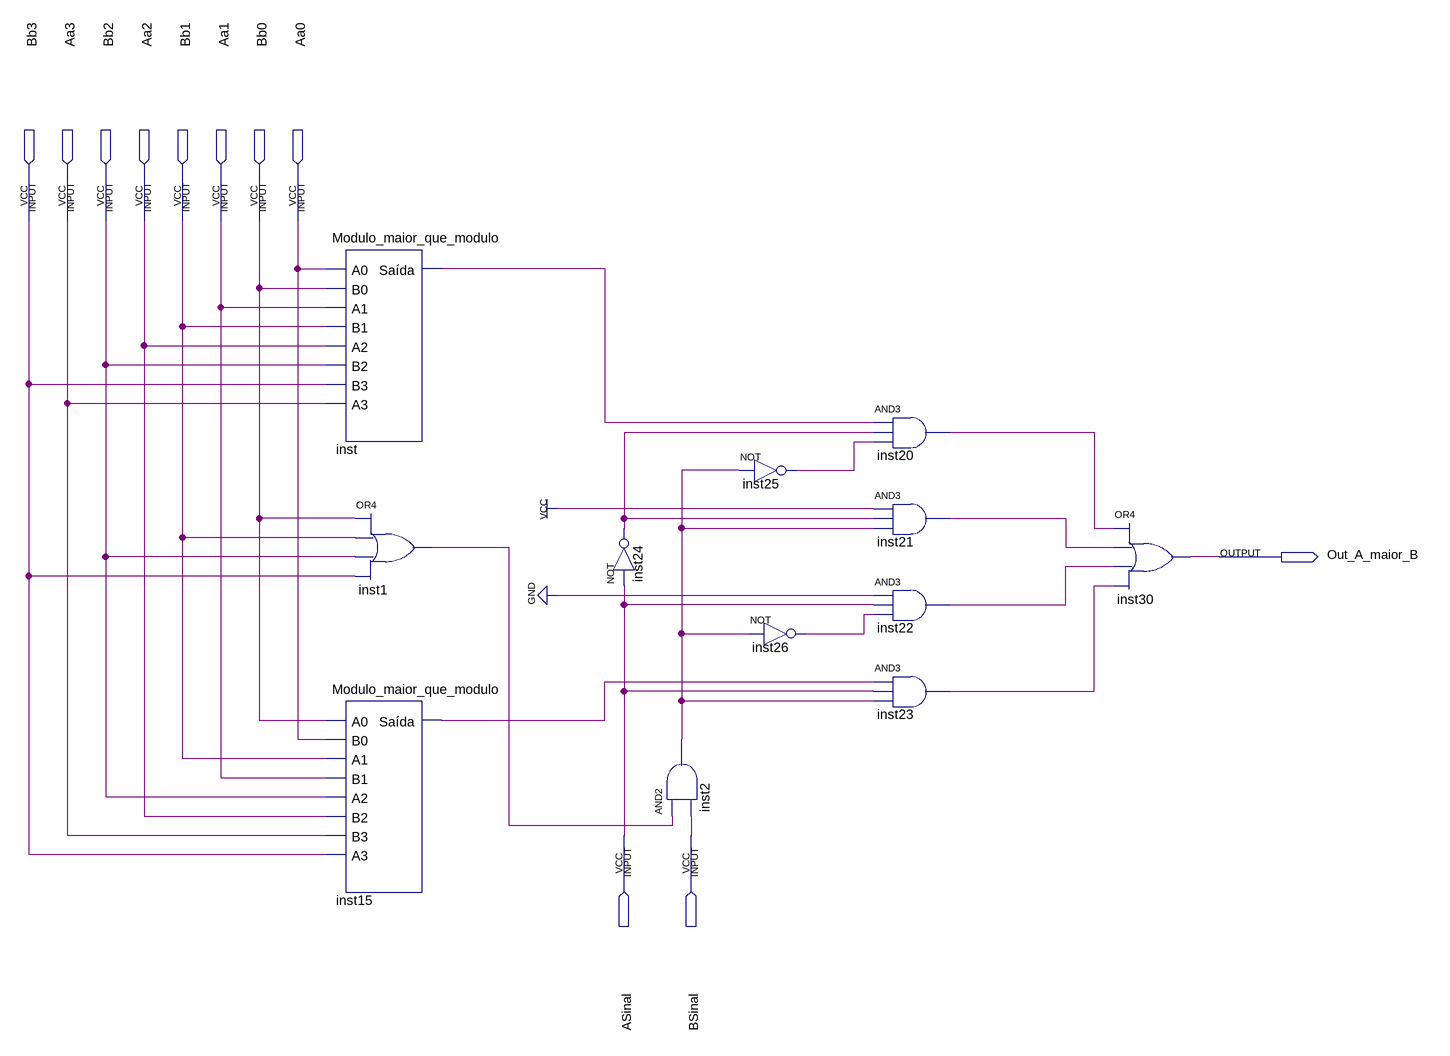
[diagram p0: schematic sheet]
// Quartus schematic A_maior_que_B.bdf as structural Verilog: 12 symbols, 11 pins
module A_maior_que_B (
  input  Bb3,
  input  Aa3,
  input  Bb2,
  input  Aa2,
  input  Bb1,
  input  Aa1,
  input  Bb0,
  input  Aa0,
  input  ASinal,
  input  BSinal,
  output Out_A_maior_B
);

  wire inst1_out, inst2_out, \inst15_saída , inst20_out, inst21_out, inst22_out, inst23_out, inst24_out,
       inst25_out, inst26_out, \inst_saída ;

  Modulo_maior_que_modulo inst (
    .A0(Aa0), .B0(Bb0), .A1(Aa1), .B1(Bb1), .A2(Aa2), .B2(Bb2), .B3(Bb3), .A3(Aa3), .\Saída (\inst_saída ));
  Modulo_maior_que_modulo inst15 (
    .A0(Bb0), .B0(Aa0), .A1(Bb1), .B1(Aa1), .A2(Bb2), .B2(Aa2), .B3(Aa3), .A3(Bb3), .\Saída (\inst15_saída ));
  or inst1 (inst1_out, Bb0, Bb1, Bb2, Bb3);
  not inst24 (inst24_out, ASinal);
  and inst2 (inst2_out, inst1_out, BSinal);
  not inst25 (inst25_out, inst2_out);
  not inst26 (inst26_out, inst2_out);
  and inst20 (inst20_out, \inst_saída , inst24_out, inst25_out);
  and inst21 (inst21_out, 1'b1, inst24_out, inst2_out);
  and inst22 (inst22_out, 1'b0, ASinal, inst26_out);
  and inst23 (inst23_out, \inst15_saída , ASinal, inst2_out);
  or inst30 (Out_A_maior_B, inst20_out, inst21_out, inst22_out, inst23_out);
endmodule
